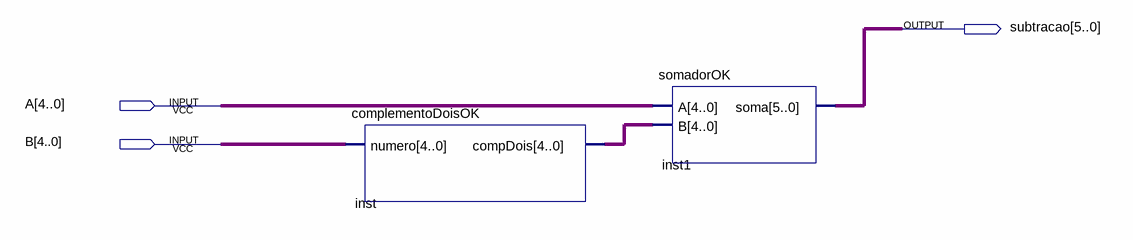
[diagram p0: schematic sheet]
// Quartus schematic subtratorOK.bdf as structural Verilog: 2 symbols, 3 pins
module subtratorOK (
  input  [4:0] A,
  input  [4:0] B,
  output [5:0] subtracao
);

  wire [4:0] inst_compdois;

  complementoDoisOK inst (.numero(B), .compDois(inst_compdois));
  somadorOK inst1 (.A(A), .B(inst_compdois), .soma(subtracao));
endmodule
